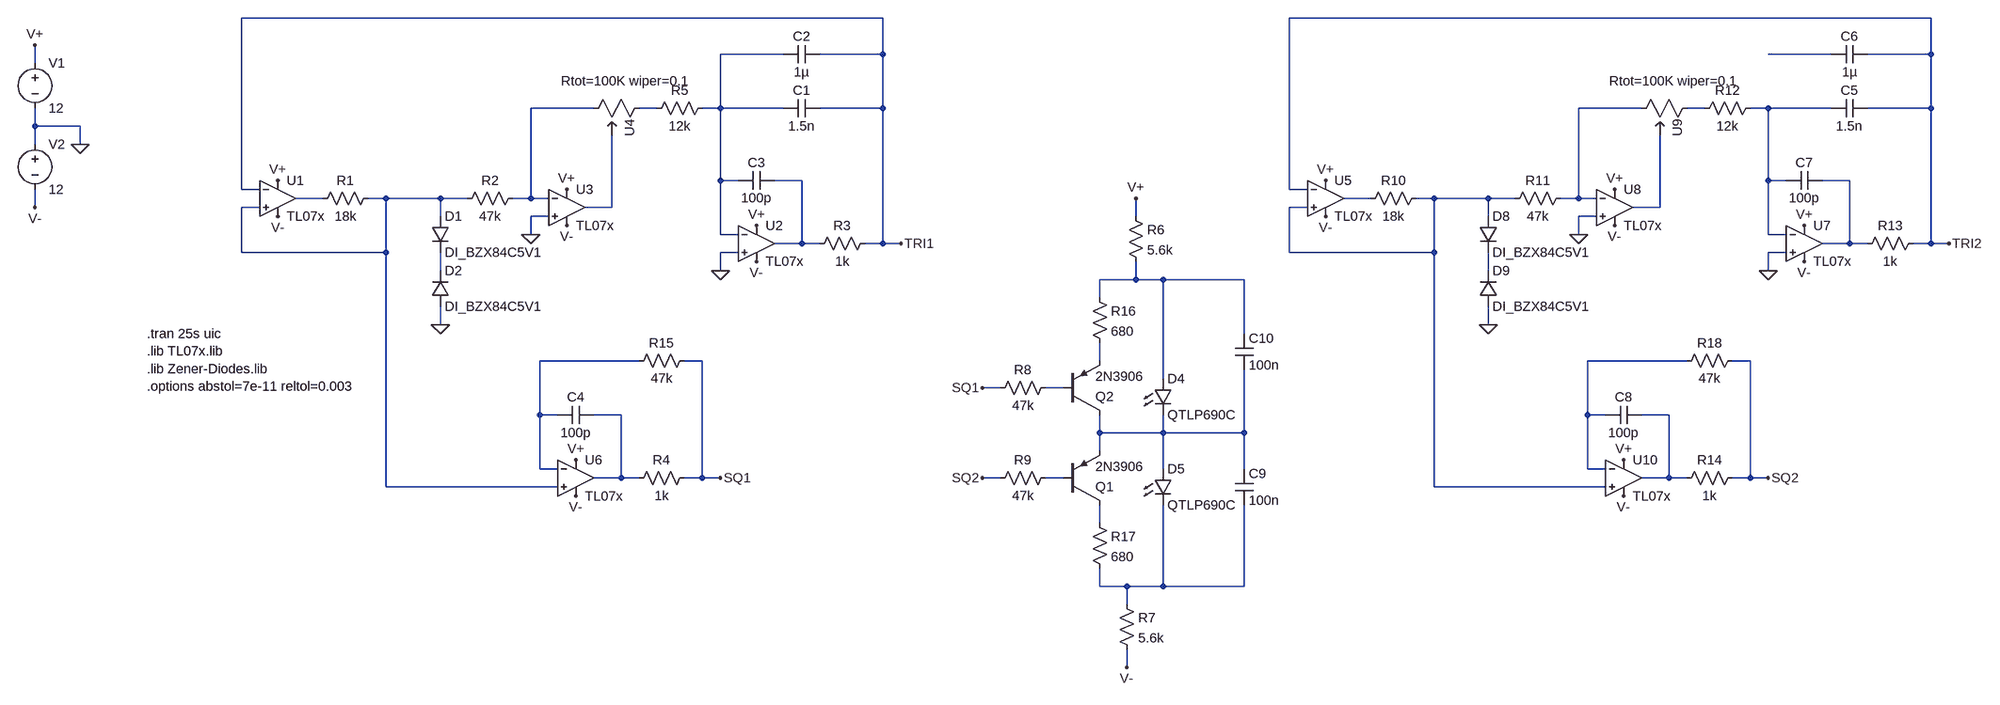
[diagram p0: schematic FG.asc]
FG.asc, the LTspice schematic file:
Version 4
SHEET 1 3232 1212
WIRE 1040 -48 -96 -48
WIRE 2896 -48 1760 -48
WIRE 864 16 752 16
WIRE 1040 16 1040 -48
WIRE 1040 16 928 16
WIRE 2720 16 2608 16
WIRE 2896 16 2896 -48
WIRE 2896 16 2784 16
WIRE -512 32 -512 0
WIRE 528 112 416 112
WIRE 640 112 608 112
WIRE 752 112 752 16
WIRE 752 112 720 112
WIRE 864 112 752 112
WIRE 1040 112 1040 16
WIRE 1040 112 928 112
WIRE 2384 112 2272 112
WIRE 2496 112 2464 112
WIRE 2608 112 2576 112
WIRE 2720 112 2608 112
WIRE 2896 112 2896 16
WIRE 2896 112 2784 112
WIRE -512 144 -512 112
WIRE -432 144 -512 144
WIRE -512 176 -512 144
WIRE -432 176 -432 144
WIRE 752 240 752 112
WIRE 784 240 752 240
WIRE 896 240 848 240
WIRE 2608 240 2608 112
WIRE 2640 240 2608 240
WIRE 2752 240 2704 240
WIRE -96 256 -96 -48
WIRE -64 256 -96 256
WIRE 1760 256 1760 -48
WIRE 1792 256 1760 256
WIRE 48 272 0 272
WIRE 160 272 128 272
WIRE 256 272 160 272
WIRE 304 272 256 272
WIRE 416 272 416 112
WIRE 416 272 384 272
WIRE 448 272 416 272
WIRE 1904 272 1856 272
WIRE 2016 272 1984 272
WIRE 2112 272 2016 272
WIRE 2160 272 2112 272
WIRE 2272 272 2272 112
WIRE 2272 272 2240 272
WIRE 2304 272 2272 272
WIRE -512 288 -512 256
WIRE -64 288 -96 288
WIRE 560 288 560 160
WIRE 560 288 512 288
WIRE 1792 288 1760 288
WIRE 2416 288 2416 160
WIRE 2416 288 2368 288
WIRE 256 304 256 272
WIRE 448 304 416 304
WIRE 1488 304 1488 272
WIRE 2112 304 2112 272
WIRE 2304 304 2272 304
WIRE 416 336 416 304
WIRE 752 336 752 240
WIRE 784 336 752 336
WIRE 2272 336 2272 304
WIRE 2608 336 2608 240
WIRE 2640 336 2608 336
WIRE 896 352 896 240
WIRE 896 352 848 352
WIRE 928 352 896 352
WIRE 1040 352 1040 112
WIRE 1040 352 1008 352
WIRE 1072 352 1040 352
WIRE 2752 352 2752 240
WIRE 2752 352 2704 352
WIRE 2784 352 2752 352
WIRE 2896 352 2896 112
WIRE 2896 352 2864 352
WIRE 2928 352 2896 352
WIRE -96 368 -96 288
WIRE 160 368 160 272
WIRE 160 368 -96 368
WIRE 784 368 752 368
WIRE 1760 368 1760 288
WIRE 2016 368 2016 272
WIRE 2016 368 1760 368
WIRE 2640 368 2608 368
WIRE 256 400 256 368
WIRE 752 400 752 368
WIRE 2112 400 2112 368
WIRE 2608 400 2608 368
WIRE 1488 416 1488 384
WIRE 1488 416 1424 416
WIRE 1536 416 1488 416
WIRE 1680 416 1536 416
WIRE 1424 448 1424 416
WIRE 256 496 256 464
WIRE 2112 496 2112 464
WIRE 1680 512 1680 416
WIRE 608 560 432 560
WIRE 720 560 688 560
WIRE 1424 560 1424 528
WIRE 2464 560 2288 560
WIRE 2576 560 2544 560
WIRE 1536 592 1536 416
WIRE 1248 608 1216 608
WIRE 1360 608 1328 608
WIRE 432 656 432 560
WIRE 464 656 432 656
WIRE 576 656 528 656
WIRE 2288 656 2288 560
WIRE 2320 656 2288 656
WIRE 2432 656 2384 656
WIRE 1424 688 1424 656
WIRE 1536 688 1536 656
WIRE 1536 688 1424 688
WIRE 1680 688 1680 576
WIRE 1680 688 1536 688
WIRE 1424 720 1424 688
WIRE 432 752 432 656
WIRE 464 752 432 752
WIRE 1536 752 1536 688
WIRE 1680 752 1680 688
WIRE 2288 752 2288 656
WIRE 2320 752 2288 752
WIRE 576 768 576 656
WIRE 576 768 528 768
WIRE 608 768 576 768
WIRE 720 768 720 560
WIRE 720 768 688 768
WIRE 752 768 720 768
WIRE 1248 768 1216 768
WIRE 1360 768 1328 768
WIRE 2432 768 2432 656
WIRE 2432 768 2384 768
WIRE 2464 768 2432 768
WIRE 2576 768 2576 560
WIRE 2576 768 2544 768
WIRE 2608 768 2576 768
WIRE 160 784 160 368
WIRE 464 784 160 784
WIRE 2016 784 2016 368
WIRE 2320 784 2016 784
WIRE 1424 848 1424 816
WIRE 1424 960 1424 928
WIRE 1472 960 1424 960
WIRE 1536 960 1536 816
WIRE 1536 960 1472 960
WIRE 1680 960 1680 816
WIRE 1680 960 1536 960
WIRE 1472 992 1472 960
WIRE 1472 1104 1472 1072
FLAG -432 176 0
FLAG -512 0 V+
FLAG -512 288 V-
FLAG -32 240 V+
FLAG -32 304 V-
FLAG 816 320 V+
FLAG 816 384 V-
FLAG 752 400 0
FLAG 256 496 0
FLAG 480 256 V+
FLAG 480 320 V-
FLAG 416 336 0
FLAG 496 736 V+
FLAG 496 800 V-
FLAG 752 768 SQ1
FLAG 1072 352 TRI1
FLAG 1824 240 V+
FLAG 1824 304 V-
FLAG 2672 320 V+
FLAG 2672 384 V-
FLAG 2608 400 0
FLAG 2112 496 0
FLAG 2336 256 V+
FLAG 2336 320 V-
FLAG 2272 336 0
FLAG 2352 736 V+
FLAG 2352 800 V-
FLAG 2608 768 SQ2
FLAG 2928 352 TRI2
FLAG 1488 272 V+
FLAG 1472 1104 V-
FLAG 1216 608 SQ1
FLAG 1216 768 SQ2
SYMBOL voltage -512 16 R0
SYMATTR InstName V1
SYMATTR Value 12
SYMBOL voltage -512 160 R0
SYMATTR InstName V2
SYMATTR Value 12
SYMBOL OpAmps/opamp2 -32 208 R0
SYMATTR InstName U1
SYMATTR Value TL07x
SYMBOL OpAmps/opamp2 816 288 R0
SYMATTR InstName U2
SYMATTR Value TL07x
SYMBOL cap 928 96 R90
WINDOW 0 0 32 VBottom 2
WINDOW 3 32 32 VTop 2
SYMATTR InstName C1
SYMATTR Value 1.5n
SYMBOL res 32 288 R270
WINDOW 0 32 56 VTop 2
WINDOW 3 0 56 VBottom 2
SYMATTR InstName R1
SYMATTR Value 18k
SYMBOL diode 240 304 R0
SYMATTR InstName D1
SYMATTR Value DI_BZX84C5V1
SYMATTR Prefix X
SYMBOL diode 240 464 M180
WINDOW 0 24 64 Left 2
WINDOW 3 24 0 Left 2
SYMATTR InstName D2
SYMATTR Value DI_BZX84C5V1
SYMATTR Prefix X
SYMBOL OpAmps/opamp2 480 224 R0
SYMATTR InstName U3
SYMATTR Value TL07x
SYMBOL res 288 288 R270
WINDOW 0 32 56 VTop 2
WINDOW 3 0 56 VBottom 2
SYMATTR InstName R2
SYMATTR Value 47k
SYMBOL potentiometer 624 96 R90
WINDOW 3 -32 154 VLeft 2
SYMATTR Value Rtot=100K wiper=0.1
SYMATTR InstName U4
SYMBOL res 624 128 R270
WINDOW 0 32 56 VTop 2
WINDOW 3 0 56 VBottom 2
SYMATTR InstName R5
SYMATTR Value 12k
SYMBOL cap 928 0 R90
WINDOW 0 0 32 VBottom 2
WINDOW 3 32 32 VTop 2
SYMATTR InstName C2
SYMATTR Value 1µ
SYMBOL OpAmps/opamp2 496 704 R0
SYMATTR InstName U6
SYMATTR Value TL07x
SYMBOL res 912 368 R270
WINDOW 0 32 56 VTop 2
WINDOW 3 0 56 VBottom 2
SYMATTR InstName R3
SYMATTR Value 1k
SYMBOL cap 848 224 R90
WINDOW 0 0 32 VBottom 2
WINDOW 3 32 32 VTop 2
SYMATTR InstName C3
SYMATTR Value 100p
SYMBOL res 592 784 R270
WINDOW 0 32 56 VTop 2
WINDOW 3 0 56 VBottom 2
SYMATTR InstName R4
SYMATTR Value 1k
SYMBOL cap 528 640 R90
WINDOW 0 0 32 VBottom 2
WINDOW 3 32 32 VTop 2
SYMATTR InstName C4
SYMATTR Value 100p
SYMBOL LED 1520 592 R0
SYMATTR InstName D4
SYMATTR Value QTLP690C
SYMBOL LED 1520 752 R0
SYMATTR InstName D5
SYMATTR Value QTLP690C
SYMBOL res 1472 288 R0
SYMATTR InstName R6
SYMATTR Value 5.6k
SYMBOL res 1456 976 R0
SYMATTR InstName R7
SYMATTR Value 5.6k
SYMBOL pnp 1360 816 M180
SYMATTR InstName Q1
SYMATTR Value 2N3906
SYMBOL pnp 1360 656 M180
SYMATTR InstName Q2
SYMATTR Value 2N3906
SYMBOL res 1232 624 R270
WINDOW 0 32 56 VTop 2
WINDOW 3 0 56 VBottom 2
SYMATTR InstName R8
SYMATTR Value 47k
SYMBOL res 1232 784 R270
WINDOW 0 32 56 VTop 2
WINDOW 3 0 56 VBottom 2
SYMATTR InstName R9
SYMATTR Value 47k
SYMBOL OpAmps/opamp2 1824 208 R0
SYMATTR InstName U5
SYMATTR Value TL07x
SYMBOL OpAmps/opamp2 2672 288 R0
SYMATTR InstName U7
SYMATTR Value TL07x
SYMBOL cap 2784 96 R90
WINDOW 0 0 32 VBottom 2
WINDOW 3 32 32 VTop 2
SYMATTR InstName C5
SYMATTR Value 1.5n
SYMBOL res 1888 288 R270
WINDOW 0 32 56 VTop 2
WINDOW 3 0 56 VBottom 2
SYMATTR InstName R10
SYMATTR Value 18k
SYMBOL diode 2096 304 R0
SYMATTR InstName D8
SYMATTR Value DI_BZX84C5V1
SYMATTR Prefix X
SYMBOL diode 2096 464 M180
WINDOW 0 24 64 Left 2
WINDOW 3 24 0 Left 2
SYMATTR InstName D9
SYMATTR Value DI_BZX84C5V1
SYMATTR Prefix X
SYMBOL OpAmps/opamp2 2336 224 R0
SYMATTR InstName U8
SYMATTR Value TL07x
SYMBOL res 2144 288 R270
WINDOW 0 32 56 VTop 2
WINDOW 3 0 56 VBottom 2
SYMATTR InstName R11
SYMATTR Value 47k
SYMBOL potentiometer 2480 96 R90
WINDOW 3 -32 154 VLeft 2
SYMATTR Value Rtot=100K wiper=0.1
SYMATTR InstName U9
SYMBOL res 2480 128 R270
WINDOW 0 32 56 VTop 2
WINDOW 3 0 56 VBottom 2
SYMATTR InstName R12
SYMATTR Value 12k
SYMBOL cap 2784 0 R90
WINDOW 0 0 32 VBottom 2
WINDOW 3 32 32 VTop 2
SYMATTR InstName C6
SYMATTR Value 1µ
SYMBOL OpAmps/opamp2 2352 704 R0
SYMATTR InstName U10
SYMATTR Value TL07x
SYMBOL res 2768 368 R270
WINDOW 0 32 56 VTop 2
WINDOW 3 0 56 VBottom 2
SYMATTR InstName R13
SYMATTR Value 1k
SYMBOL cap 2704 224 R90
WINDOW 0 0 32 VBottom 2
WINDOW 3 32 32 VTop 2
SYMATTR InstName C7
SYMATTR Value 100p
SYMBOL res 2448 784 R270
WINDOW 0 32 56 VTop 2
WINDOW 3 0 56 VBottom 2
SYMATTR InstName R14
SYMATTR Value 1k
SYMBOL cap 2384 640 R90
WINDOW 0 0 32 VBottom 2
WINDOW 3 32 32 VTop 2
SYMATTR InstName C8
SYMATTR Value 100p
SYMBOL cap 1664 512 R0
SYMATTR InstName C10
SYMATTR Value 100n
SYMBOL cap 1664 752 R0
SYMATTR InstName C9
SYMATTR Value 100n
SYMBOL res 592 576 R270
WINDOW 0 32 56 VTop 2
WINDOW 3 0 56 VBottom 2
SYMATTR InstName R15
SYMATTR Value 47k
SYMBOL res 1408 432 R0
SYMATTR InstName R16
SYMATTR Value 680
SYMBOL res 1408 832 R0
SYMATTR InstName R17
SYMATTR Value 680
SYMBOL res 2448 576 R270
WINDOW 0 32 56 VTop 2
WINDOW 3 0 56 VBottom 2
SYMATTR InstName R18
SYMATTR Value 47k
TEXT -264 512 Left 2 !.tran 25s uic\n.lib TL07x.lib\n.lib Zener-Diodes.lib\n.options abstol=7e-11 reltol=0.003

The netlist it stands for:
* FG.asc
V1 V+ 0 12
V2 0 V- 12
XU1 N011 TRI1 V+ V- N010 TL07x  ; pins In+ In- V+ V- OUT
XU2 0 N001 V+ V- N008 TL07x  ; pins In+ In- V+ V- OUT
C1 TRI1 N001 1.5n
R1 N010 N011 18k
XD1 N011 N016 DI_BZX84C5V1  ; pins + -
XD2 0 N016 DI_BZX84C5V1  ; pins + -
XU3 0 N003 V+ V- N014 TL07x  ; pins In+ In- V+ V- OUT
R2 N011 N003 47k
XU4 N004 N003 N014 potentiometer Rtot=100K wiper=0.1  ; pins A B C
R5 N004 N001 12k
C2 TRI1 N001 1µ
XU6 N011 N019 V+ V- N023 TL07x  ; pins In+ In- V+ V- OUT
R3 N008 TRI1 1k
C3 N008 N001 100p
R4 N023 SQ1 1k
C4 N023 N019 100p
D4 N018 N025 QTLP690C
D5 N025 N028 QTLP690C
R6 V+ N018 5.6k
R7 N028 V- 5.6k
Q1 N027 N026 N025 0 2N3906
Q2 N025 N022 N020 0 2N3906
R8 SQ1 N022 47k
R9 SQ2 N026 47k
XU5 N013 TRI2 V+ V- N012 TL07x  ; pins In+ In- V+ V- OUT
XU7 0 N007 V+ V- N009 TL07x  ; pins In+ In- V+ V- OUT
C5 TRI2 N007 1.5n
R10 N012 N013 18k
XD8 N013 N017 DI_BZX84C5V1  ; pins + -
XD9 0 N017 DI_BZX84C5V1  ; pins + -
XU8 0 N005 V+ V- N015 TL07x  ; pins In+ In- V+ V- OUT
R11 N013 N005 47k
XU9 N006 N005 N015 potentiometer Rtot=100K wiper=0.1  ; pins A B C
R12 N006 N007 12k
C6 TRI2 N002 1µ
XU10 N013 N021 V+ V- N024 TL07x  ; pins In+ In- V+ V- OUT
R13 N009 TRI2 1k
C7 N009 N007 100p
R14 N024 SQ2 1k
C8 N024 N021 100p
C10 N018 N025 100n
C9 N025 N028 100n
R15 N019 SQ1 47k
R16 N018 N020 680
R17 N027 N028 680
R18 N021 SQ2 47k
.model D D
.lib standard.dio
.model NPN NPN
.model PNP PNP
.lib standard.bjt
.tran 25s uic
.lib TL07x.lib
.lib Zener-Diodes.lib
.options abstol=7e-11 reltol=0.003
.lib potentiometer.lib
.backanno
.end